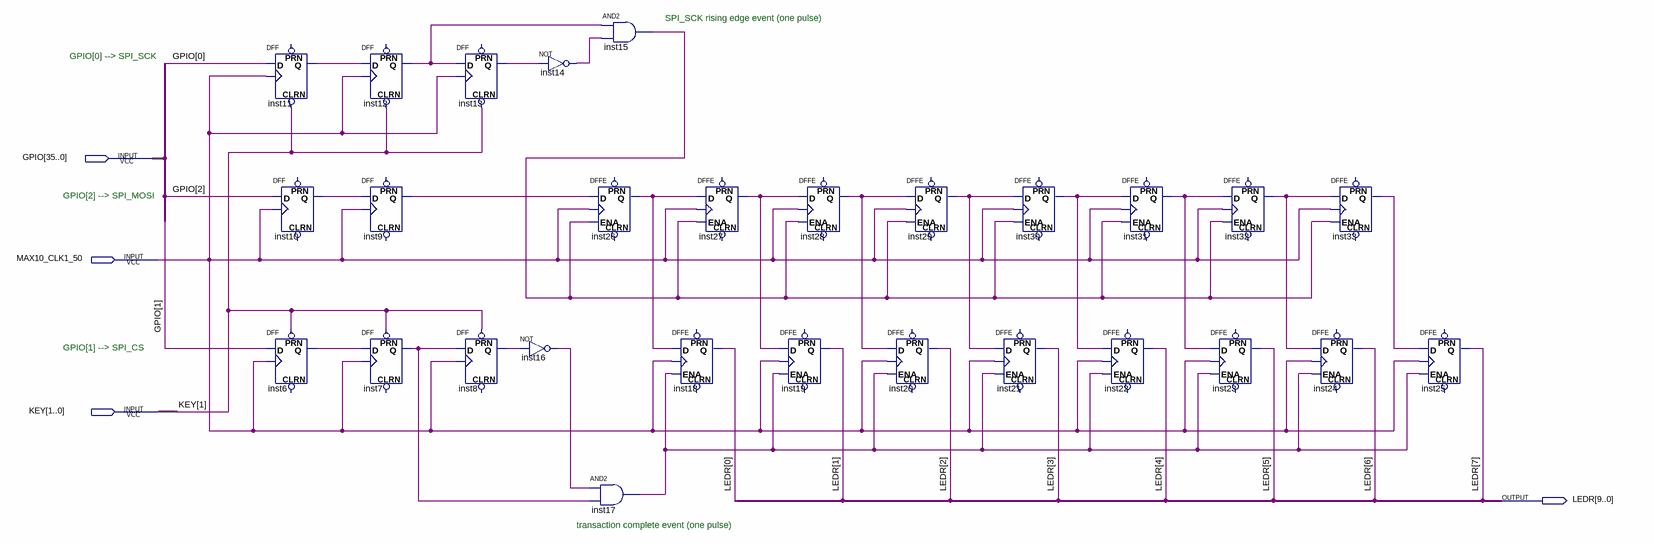
[diagram p0: schematic sheet]
// Quartus schematic simple_spi.bdf as structural Verilog: 28 symbols, 4 pins
module simple_spi (
  input  [35:0] GPIO,
  input  MAX10_CLK1_50,
  input  [1:0] KEY,
  output [9:0] LEDR
);

  wire inst6_q, inst7_q, inst8_q, inst9_q, inst10_q, inst11_q, inst12_q, inst13_q, inst14_out, inst15_out,
       inst16_out, inst17_out, inst26_q, inst27_q, inst28_q, inst29_q, inst30_q, inst31_q, inst32_q, inst33_q;

  DFF inst11 (.CLRN(KEY[1]), .CLK(MAX10_CLK1_50), .D(GPIO[0]), .Q(inst11_q));  // open: PRN
  DFF inst10 (.CLK(MAX10_CLK1_50), .D(GPIO[2]), .Q(inst10_q));  // open: CLRN, PRN
  DFF inst6 (.CLK(MAX10_CLK1_50), .D(GPIO[1]), .PRN(KEY[1]), .Q(inst6_q));  // open: CLRN
  DFF inst12 (.CLRN(KEY[1]), .CLK(MAX10_CLK1_50), .D(inst11_q), .Q(inst12_q));  // open: PRN
  DFF inst9 (.CLK(MAX10_CLK1_50), .D(inst10_q), .Q(inst9_q));  // open: CLRN, PRN
  DFF inst7 (.CLK(MAX10_CLK1_50), .D(inst6_q), .PRN(KEY[1]), .Q(inst7_q));  // open: CLRN
  DFF inst13 (.CLRN(KEY[1]), .CLK(MAX10_CLK1_50), .D(inst12_q), .Q(inst13_q));  // open: PRN
  DFF inst8 (.CLK(MAX10_CLK1_50), .D(inst7_q), .PRN(KEY[1]), .Q(inst8_q));  // open: CLRN
  not inst14 (inst14_out, inst13_q);
  not inst16 (inst16_out, inst8_q);
  and inst15 (inst15_out, inst12_q, inst14_out);
  DFFE inst26 (.D(inst9_q), .CLK(MAX10_CLK1_50), .ENA(inst15_out), .Q(inst26_q));  // open: PRN, CLRN
  and inst17 (inst17_out, inst16_out, inst7_q);
  DFFE inst27 (.D(inst26_q), .CLK(MAX10_CLK1_50), .ENA(inst15_out), .Q(inst27_q));  // open: PRN, CLRN
  DFFE inst18 (.D(inst26_q), .CLK(MAX10_CLK1_50), .ENA(inst17_out), .Q(LEDR[0]));  // open: PRN, CLRN
  DFFE inst28 (.D(inst27_q), .CLK(MAX10_CLK1_50), .ENA(inst15_out), .Q(inst28_q));  // open: PRN, CLRN
  DFFE inst19 (.D(inst27_q), .CLK(MAX10_CLK1_50), .ENA(inst17_out), .Q(LEDR[1]));  // open: PRN, CLRN
  DFFE inst29 (.D(inst28_q), .CLK(MAX10_CLK1_50), .ENA(inst15_out), .Q(inst29_q));  // open: PRN, CLRN
  DFFE inst20 (.D(inst28_q), .CLK(MAX10_CLK1_50), .ENA(inst17_out), .Q(LEDR[2]));  // open: PRN, CLRN
  DFFE inst21 (.D(inst29_q), .CLK(MAX10_CLK1_50), .ENA(inst17_out), .Q(LEDR[3]));  // open: PRN, CLRN
  DFFE inst30 (.D(inst29_q), .CLK(MAX10_CLK1_50), .ENA(inst15_out), .Q(inst30_q));  // open: PRN, CLRN
  DFFE inst22 (.D(inst30_q), .CLK(MAX10_CLK1_50), .ENA(inst17_out), .Q(LEDR[4]));  // open: PRN, CLRN
  DFFE inst31 (.D(inst30_q), .CLK(MAX10_CLK1_50), .ENA(inst15_out), .Q(inst31_q));  // open: PRN, CLRN
  DFFE inst23 (.D(inst31_q), .CLK(MAX10_CLK1_50), .ENA(inst17_out), .Q(LEDR[5]));  // open: PRN, CLRN
  DFFE inst32 (.D(inst31_q), .CLK(MAX10_CLK1_50), .ENA(inst15_out), .Q(inst32_q));  // open: PRN, CLRN
  DFFE inst24 (.D(inst32_q), .CLK(MAX10_CLK1_50), .ENA(inst17_out), .Q(LEDR[6]));  // open: PRN, CLRN
  DFFE inst33 (.D(inst32_q), .CLK(MAX10_CLK1_50), .ENA(inst15_out), .Q(inst33_q));  // open: PRN, CLRN
  DFFE inst25 (.D(inst33_q), .CLK(MAX10_CLK1_50), .ENA(inst17_out), .Q(LEDR[7]));  // open: PRN, CLRN

  // Notes on the sheet:
  //   SPI_SCK rising edge event (one pulse)
  //   GPIO[0] --> SPI_SCK
  //   GPIO[2] --> SPI_MOSI
  //   GPIO[1] --> SPI_CS
  //   transaction complete event (one pulse)
endmodule
